# EAGLE schematic Display (EAGLE 7.2.0)
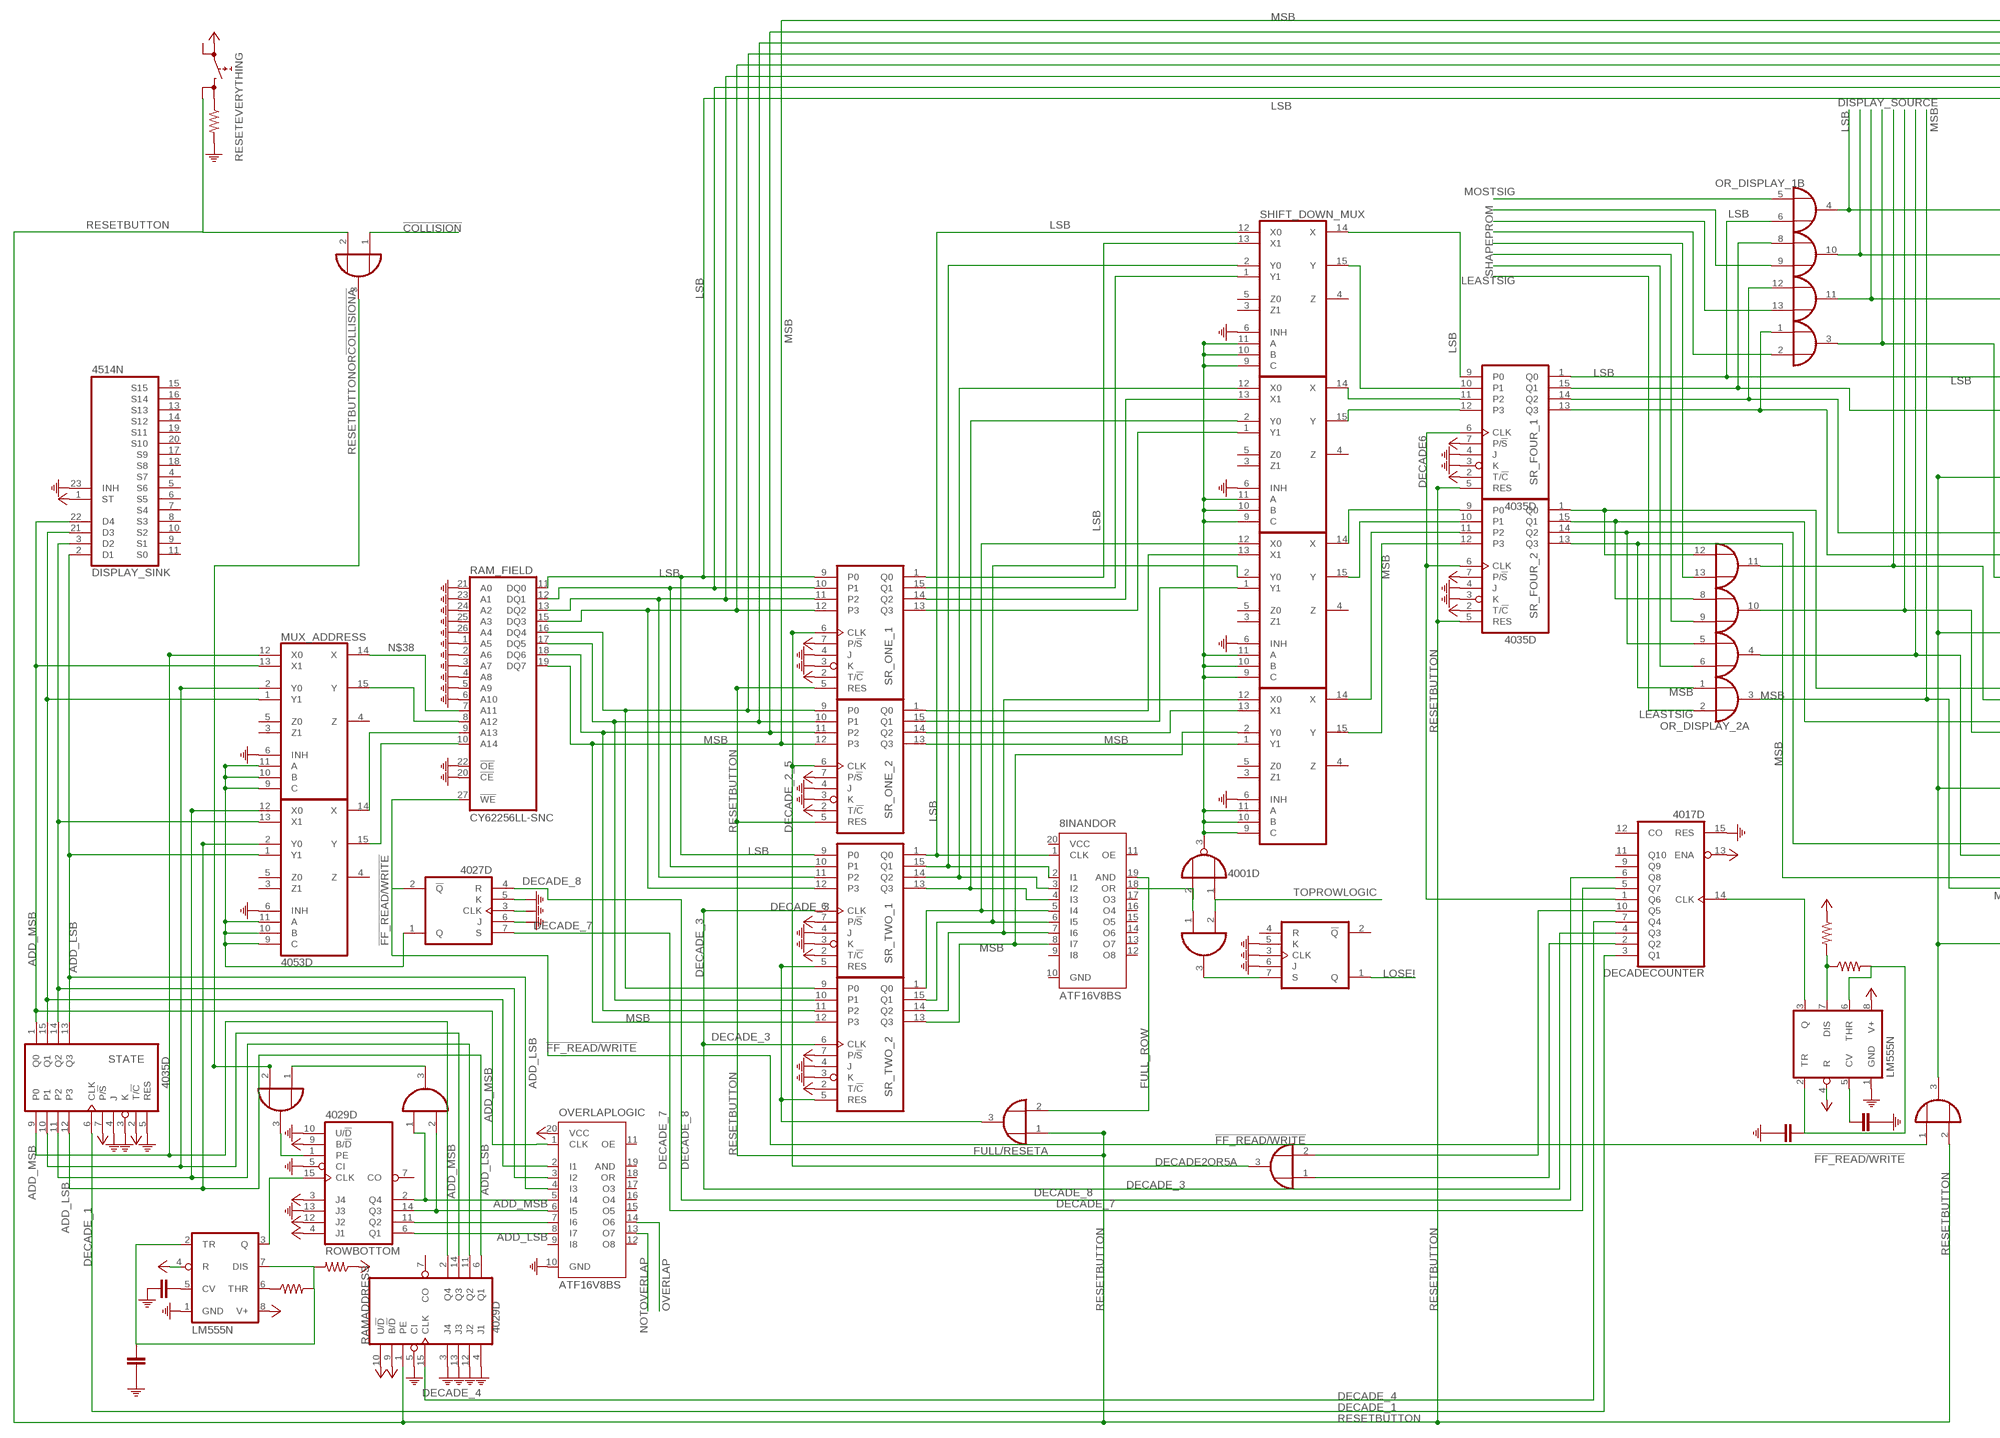
[diagram p0: schematic, sheet 1, part 1 of 2]
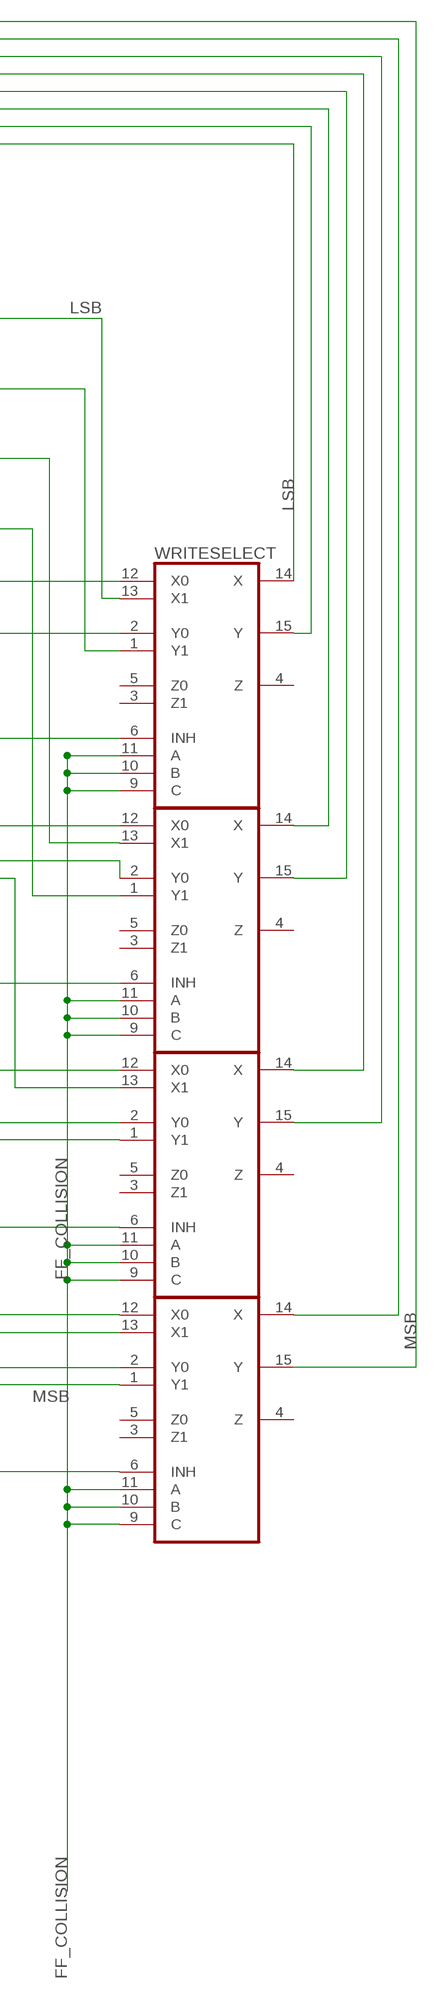
[diagram p1: schematic, sheet 1, part 2 of 2]

## Parts
1/3HZ  LM555N  [DIL08]
8INANDOR  ATF16V8BS  [SO20L]
9KHZ  LM555N  [DIL08]
DECADE2OR5  4071D  [SO14]
DECADECOUNTER  4017D  [SO16]
DISPLAY_SINK  4514N  [DIL24-6]
FF_R/W(H=WRITE)  4027D  [SO16]
FULL/RESET  4071D  [SO14]
IC1  4071D  [SO14]
IC3  4071D  [SO14]
IC8  4081D  [SO14]
IC9  4027D  [SO16]
IC10  4053D  [SO16]
IC13  4001D  [SO14]
IC15  4081D  [SO14]
IC16  4053D  [SO16]
IC17  4053D  [SO16]
IC18  4053D  [SO16]
IC20  4053D  [SO16]
IC21  4053D  [SO16]
IC22  4053D  [SO16]
MUX_ADDRESS  4053D  [SO16]
OR_DISPLAY_1  4071D  [SO14]
OR_DISPLAY_2  4071D  [SO14]
OVERLAPLOGIC  ATF16V8BS  [SO20L]
R1  R-US_0204/7  [0204/7]
R4  R-US_0204/7  [0204/7]
R5  R-US_0204/7  [0204/7]
R6  R-US_0204/7  [0204/7]
R7  R-US_0204/7  [0204/7]
RAM_FIELD  CY62256LL-SNC  [SOJ28/3]
RAMADDRESS  4029D  [SO16]
RESETBUTTONOR!COLLISION  4071D  [SO14]
RESETEVERYTHING  REKN  [REKN]
ROWBOTTOM  4029D  [SO16]
SHIFT_DOWN_MUX  4053D  [SO16]
SR_FOUR_1  4035D  [SO16]
SR_FOUR_2  4035D  [SO16]
SR_ONE_1  4035D  [SO16]
SR_ONE_2  4035D  [SO16]
SR_TWO_1  4035D  [SO16]
SR_TWO_2  4035D  [SO16]
STATE  4035D  [SO16]
WRITESELECT  4053D  [SO16]

## Nets
!COLLISION: RESETBUTTONOR!COLLISION.1(A:I0)
!FF_READ/WRITE: FF_R/W(H=WRITE).2(A:!Q) IC1.1(A:I0) RAM_FIELD.27(!WE)
ADD_LSB: DISPLAY_SINK.2(D1) IC10.1(Y1) IC10.2(Y0) OVERLAPLOGIC.4(I3) OVERLAPLOGIC.8(I7) RAMADDRESS.6(Q1) ROWBOTTOM.6(Q1) STATE.12(P3) STATE.13(Q3)
ADD_MSB: DISPLAY_SINK.22(D4) IC8.1(A:I0) MUX_ADDRESS.12(X0) MUX_ADDRESS.13(X1) OVERLAPLOGIC.5(I4) RAMADDRESS.2(Q4) ROWBOTTOM.2(Q4) STATE.1(Q0) STATE.9(P0)
DECADE6: DECADECOUNTER.1(Q6) SR_FOUR_1.6(CLK) SR_FOUR_2.6(CLK)
DECADE_1: DECADECOUNTER.3(Q1) STATE.6(CLK)
DECADE_2_5: DECADE2OR5.3(A:O) SR_ONE_1.6(CLK) SR_ONE_2.6(CLK)
DECADE_3: DECADECOUNTER.4(Q3) SR_TWO_1.6(CLK) SR_TWO_2.6(CLK)
DECADE_4: DECADECOUNTER.7(Q4) RAMADDRESS.15(CLK)
DECADE_7: DECADECOUNTER.5(Q7) FF_R/W(H=WRITE).7(A:S)
DECADE_8: DECADECOUNTER.6(Q8) FF_R/W(H=WRITE).4(A:R)
DISPLAY_SOURCE: OR_DISPLAY_1.10(C:O) WRITESELECT.1(Y1)
FF_COLLISION: IC20.9(C) IC20.10(B) IC20.11(A) IC21.9(C) IC21.10(B) IC21.11(A) IC22.9(C) IC22.10(B) IC22.11(A) WRITESELECT.9(C) WRITESELECT.10(B) WRITESELECT.11(A)
FULL_ROW: 8INANDOR.19(AND) FULL/RESET.2(A:I1)
LEASTSIG: OR_DISPLAY_2.2(A:I1)
LOSE!: IC9.1(A:Q)
LSB: 8INANDOR.1(CLK) OR_DISPLAY_1.4(B:O) OR_DISPLAY_1.6(B:I1) RAM_FIELD.11(DQ0) SHIFT_DOWN_MUX.12(X0) SHIFT_DOWN_MUX.13(X1) SHIFT_DOWN_MUX.14(X) SR_FOUR_1.1(Q0) SR_FOUR_1.9(P0) SR_ONE_1.1(Q0) SR_ONE_1.9(P0) SR_TWO_1.1(Q0) SR_TWO_1.9(P0) WRITESELECT.12(X0) WRITESELECT.13(X1) WRITESELECT.14(X)
MOSTSIG: OR_DISPLAY_1.5(B:I0)
MSB: 8INANDOR.8(I7) IC16.1(Y1) IC16.2(Y0) IC16.15(Y) IC20.1(Y1) IC20.2(Y0) IC20.15(Y) OR_DISPLAY_2.1(A:I0) OR_DISPLAY_2.3(A:O) RAM_FIELD.19(DQ7) SR_FOUR_2.12(P3) SR_FOUR_2.13(Q3) SR_ONE_2.12(P3) SR_ONE_2.13(Q3) SR_TWO_2.12(P3) SR_TWO_2.13(Q3)
N$1: 9KHZ.7(DIS) R4.2 R5.1
N$2: IC1.3(A:O) IC20.6(INH) IC21.6(INH) IC22.6(INH) WRITESELECT.6(INH)
N$3: IC8.2(A:I1) OVERLAPLOGIC.6(I5) ROWBOTTOM.14(Q3)
N$4: 9KHZ.6(THR)
N$5: IC3.3(A:O) ROWBOTTOM.1(PE)
N$6: IC3.2(A:I1) RESETBUTTONOR!COLLISION.3(A:O)
N$7: OVERLAPLOGIC.7(I6) ROWBOTTOM.11(Q2)
N$8: R1.1 RESETEVERYTHING.1A
N$9: IC10.12(X0) RAMADDRESS.11(Q2) STATE.11(P2)
N$10: 9KHZ.5(CV)
N$12: IC22.15(Y)
N$13: 1/3HZ.6(THR) R7.1
N$14: FF_R/W(H=WRITE).1(A:Q) IC10.9(C) IC10.10(B) IC10.11(A) MUX_ADDRESS.9(C) MUX_ADDRESS.10(B) MUX_ADDRESS.11(A)
N$15: IC21.15(Y) RAM_FIELD.17(DQ5) SR_ONE_2.10(P1) SR_TWO_2.10(P1)
N$16: IC20.14(X)
N$17: 1/3HZ.2(TR) 1/3HZ.7(DIS) R6.2 R7.2
N$18: 9KHZ.2(TR) R5.2
N$19: 1/3HZ.3(Q) ROWBOTTOM.15(CLK)
N$20: MUX_ADDRESS.2(Y0) RAMADDRESS.14(Q3) STATE.10(P1)
N$21: RAM_FIELD.15(DQ3) SR_ONE_1.12(P3) SR_TWO_1.12(P3)
N$22: 9KHZ.3(Q) DECADECOUNTER.14(CLK)
N$23: FULL/RESET.3(A:O) SR_TWO_1.5(RES) SR_TWO_2.5(RES)
N$24: IC3.1(A:I0) IC8.3(A:O)
N$27: DISPLAY_SINK.21(D3) MUX_ADDRESS.1(Y1) OVERLAPLOGIC.2(I1) STATE.15(Q1)
N$29: OR_DISPLAY_2.13(D:I1)
N$31: OR_DISPLAY_1.13(D:I1)
N$32: OR_DISPLAY_2.6(B:I1)
N$34: OR_DISPLAY_2.9(C:I1)
N$35: OR_DISPLAY_1.2(A:I1)
N$36: DISPLAY_SINK.3(D2) IC10.13(X1) OVERLAPLOGIC.3(I2) STATE.14(Q2)
N$38: MUX_ADDRESS.14(X) RAM_FIELD.7(A11)
N$39: MUX_ADDRESS.15(Y) RAM_FIELD.8(A12)
N$40: OVERLAPLOGIC.1(CLK)
N$42: IC10.14(X) RAM_FIELD.9(A13)
N$43: IC10.15(Y) RAM_FIELD.10(A14)
N$45: IC22.14(X) RAM_FIELD.13(DQ2) SR_ONE_1.11(P2) SR_TWO_1.11(P2)
N$46: RAM_FIELD.12(DQ1) SR_ONE_1.10(P1) SR_TWO_1.10(P1) WRITESELECT.15(Y)
N$47: IC21.14(X) RAM_FIELD.16(DQ4) SR_ONE_2.9(P0) SR_TWO_2.9(P0)
N$49: 8INANDOR.2(I1) SHIFT_DOWN_MUX.2(Y0) SR_TWO_1.15(Q1)
N$52: DECADE2OR5.1(A:I0) DECADECOUNTER.2(Q2)
N$53: IC18.15(Y) SR_FOUR_1.12(P3)
N$54: DECADE2OR5.2(A:I1) DECADECOUNTER.10(Q5)
N$55: IC18.14(X) SR_FOUR_1.11(P2)
N$56: 8INANDOR.3(I2) IC18.12(X0) SR_TWO_1.14(Q2)
N$57: RAM_FIELD.18(DQ6) SR_ONE_2.11(P2) SR_TWO_2.11(P2)
N$58: 8INANDOR.4(I3) IC18.2(Y0) SR_TWO_1.13(Q3)
N$59: 8INANDOR.5(I4) IC17.12(X0) SR_TWO_2.1(Q0)
N$60: 8INANDOR.6(I5) IC17.2(Y0) SR_TWO_2.15(Q1)
N$61: 8INANDOR.7(I6) IC16.12(X0) SR_TWO_2.14(Q2)
N$64: 8INANDOR.18(OR) IC13.2(A:I1) IC15.1(A:I0)
N$65: IC9.7(A:S) IC15.3(A:O)
N$66: IC13.3(A:O) IC16.9(C) IC16.10(B) IC16.11(A) IC17.9(C) IC17.10(B) IC17.11(A) IC18.9(C) IC18.10(B) IC18.11(A) SHIFT_DOWN_MUX.9(C) SHIFT_DOWN_MUX.10(B) SHIFT_DOWN_MUX.11(A)
N$68: SHIFT_DOWN_MUX.1(Y1) SR_ONE_1.15(Q1)
N$69: IC18.13(X1) SR_ONE_1.14(Q2)
N$70: IC18.1(Y1) SR_ONE_1.13(Q3)
N$71: IC17.13(X1) SR_ONE_2.1(Q0)
N$72: IC17.1(Y1) SR_ONE_2.15(Q1)
N$73: IC16.13(X1) SR_ONE_2.14(Q2)
N$75: SHIFT_DOWN_MUX.15(Y) SR_FOUR_1.10(P1)
N$76: IC17.14(X) SR_FOUR_2.9(P0)
N$77: IC17.15(Y) SR_FOUR_2.10(P1)
N$80: IC16.14(X) SR_FOUR_2.11(P2)
N$82: IC21.12(X0) OR_DISPLAY_2.12(D:I0) SR_FOUR_2.1(Q0)
N$83: IC22.12(X0) OR_DISPLAY_1.12(D:I0) SR_FOUR_1.14(Q2)
N$84: IC22.2(Y0) OR_DISPLAY_1.1(A:I0) SR_FOUR_1.13(Q3)
N$85: OR_DISPLAY_1.8(C:I0) SR_FOUR_1.15(Q1) WRITESELECT.2(Y0)
N$86: IC20.12(X0) OR_DISPLAY_2.5(B:I0) SR_FOUR_2.14(Q2)
N$87: IC21.2(Y0) OR_DISPLAY_2.8(C:I0) SR_FOUR_2.15(Q1)
N$92: IC22.13(X1) OR_DISPLAY_1.11(D:O)
N$93: IC22.1(Y1) OR_DISPLAY_1.3(A:O)
N$94: IC21.13(X1) OR_DISPLAY_2.11(D:O)
N$95: IC21.1(Y1) OR_DISPLAY_2.10(C:O)
N$96: IC20.13(X1) OR_DISPLAY_2.4(B:O)
NOTOVERLAP: OVERLAPLOGIC.13(O7)
OVERLAP: OVERLAPLOGIC.14(O6)
PE: 1/3HZ.1(GND) 9KHZ.1(GND) DECADECOUNTER.15(RES) DISPLAY_SINK.23(INH) FF_R/W(H=WRITE).3(A:CLK) FF_R/W(H=WRITE).5(A:K) FF_R/W(H=WRITE).6(A:J) IC9.3(A:CLK) IC9.5(A:K) IC9.6(A:J) IC10.6(INH) IC16.6(INH) IC17.6(INH) IC18.6(INH) MUX_ADDRESS.6(INH) OVERLAPLOGIC.10(GND) R1.2 RAM_FIELD.1(A5) RAM_FIELD.2(A6) RAM_FIELD.3(A7) RAM_FIELD.4(A8) RAM_FIELD.5(A9) RAM_FIELD.6(A10) RAM_FIELD.20(!CE) RAM_FIELD.21(A0) RAM_FIELD.22(!OE) RAM_FIELD.23(A1) RAM_FIELD.24(A2) RAM_FIELD.25(A3) RAM_FIELD.26(A4) RAMADDRESS.3(J4) RAMADDRESS.4(J1) RAMADDRESS.5(CI) RAMADDRESS.12(J2) RAMADDRESS.13(J3) ROWBOTTOM.5(CI) ROWBOTTOM.10(U/!D) ROWBOTTOM.13(J3) SHIFT_DOWN_MUX.6(INH) SR_FOUR_1.3(K) SR_FOUR_1.4(J) SR_FOUR_2.3(K) SR_FOUR_2.4(J) SR_ONE_1.3(K) SR_ONE_1.4(J) SR_ONE_2.3(K) SR_ONE_2.4(J) SR_TWO_1.3(K) SR_TWO_1.4(J) SR_TWO_2.3(K) SR_TWO_2.4(J) STATE.3(K) STATE.4(J) STATE.5(RES)
RESETBUTTON: FULL/RESET.1(A:I0) IC1.2(A:I1) RAMADDRESS.1(PE) RESETBUTTONOR!COLLISION.2(A:I1) RESETEVERYTHING.1B SR_FOUR_1.5(RES) SR_FOUR_2.5(RES) SR_ONE_1.5(RES) SR_ONE_2.5(RES)
SHAPEPROM: OR_DISPLAY_1.9(C:I1)
TOPROWLOGIC: IC13.1(A:I0) IC15.2(A:I1)
V+: 1/3HZ.4(R) 1/3HZ.8(V+) 9KHZ.4(R) 9KHZ.8(V+) DECADECOUNTER.13(ENA) DISPLAY_SINK.1(ST) OVERLAPLOGIC.20(VCC) R4.1 R6.1 RAMADDRESS.9(B/!D) RAMADDRESS.10(U/!D) RESETEVERYTHING.0A ROWBOTTOM.3(J4) ROWBOTTOM.4(J1) ROWBOTTOM.9(B/!D) ROWBOTTOM.12(J2) SR_FOUR_1.2(T/!C) SR_FOUR_1.7(P/!S) SR_FOUR_2.2(T/!C) SR_FOUR_2.7(P/!S) SR_ONE_1.2(T/!C) SR_ONE_1.7(P/!S) SR_ONE_2.2(T/!C) SR_ONE_2.7(P/!S) SR_TWO_1.2(T/!C) SR_TWO_1.7(P/!S) SR_TWO_2.2(T/!C) SR_TWO_2.7(P/!S) STATE.2(T/!C) STATE.7(P/!S)
Unconnected: 1/3HZ.5(CV) 8INANDOR.9(I8) 8INANDOR.11(OE) 8INANDOR.12(O8) 8INANDOR.13(O7) 8INANDOR.14(O6) 8INANDOR.15(O5) 8INANDOR.16(O4) 8INANDOR.17(O3) DECADE2OR5.4(B:O) DECADE2OR5.5(B:I0) DECADE2OR5.6(B:I1) DECADE2OR5.8(C:I0) DECADE2OR5.9(C:I1) DECADE2OR5.10(C:O) DECADE2OR5.11(D:O) DECADE2OR5.12(D:I0) DECADE2OR5.13(D:I1) DECADECOUNTER.9(Q9) DECADECOUNTER.11(Q10) DECADECOUNTER.12(CO) DISPLAY_SINK.4(S7) DISPLAY_SINK.5(S6) DISPLAY_SINK.6(S5) DISPLAY_SINK.7(S4) DISPLAY_SINK.8(S3) DISPLAY_SINK.9(S1) DISPLAY_SINK.10(S2) DISPLAY_SINK.11(S0) DISPLAY_SINK.13(S13) DISPLAY_SINK.14(S12) DISPLAY_SINK.15(S15) DISPLAY_SINK.16(S14) DISPLAY_SINK.17(S9) DISPLAY_SINK.18(S8) DISPLAY_SINK.19(S11) DISPLAY_SINK.20(S10) FF_R/W(H=WRITE).9(B:S) FF_R/W(H=WRITE).10(B:J) FF_R/W(H=WRITE).11(B:K) FF_R/W(H=WRITE).12(B:R) FF_R/W(H=WRITE).13(B:CLK) FF_R/W(H=WRITE).14(B:!Q) FF_R/W(H=WRITE).15(B:Q) FULL/RESET.4(B:O) FULL/RESET.5(B:I0) FULL/RESET.6(B:I1) FULL/RESET.8(C:I0) FULL/RESET.9(C:I1) FULL/RESET.10(C:O) FULL/RESET.11(D:O) FULL/RESET.12(D:I0) FULL/RESET.13(D:I1) IC1.4(B:O) IC1.5(B:I0) IC1.6(B:I1) IC1.8(C:I0) IC1.9(C:I1) IC1.10(C:O) IC1.11(D:O) IC1.12(D:I0) IC1.13(D:I1) IC3.4(B:O) IC3.5(B:I0) IC3.6(B:I1) IC3.8(C:I0) IC3.9(C:I1) IC3.10(C:O) IC3.11(D:O) IC3.12(D:I0) IC3.13(D:I1) IC8.4(B:O) IC8.5(B:I0) IC8.6(B:I1) IC8.8(C:I0) IC8.9(C:I1) IC8.10(C:O) IC8.11(D:O) IC8.12(D:I0) IC8.13(D:I1) IC9.2(A:!Q) IC9.4(A:R) IC9.9(B:S) IC9.10(B:J) IC9.11(B:K) IC9.12(B:R) IC9.13(B:CLK) IC9.14(B:!Q) IC9.15(B:Q) IC10.3(Z1) IC10.4(Z) IC10.5(Z0) IC13.4(B:O) IC13.5(B:I0) IC13.6(B:I1) IC13.8(C:I0) IC13.9(C:I1) IC13.10(C:O) IC13.11(D:O) IC13.12(D:I0) IC13.13(D:I1) IC15.4(B:O) IC15.5(B:I0) IC15.6(B:I1) IC15.8(C:I0) IC15.9(C:I1) IC15.10(C:O) IC15.11(D:O) IC15.12(D:I0) IC15.13(D:I1) IC16.3(Z1) IC16.4(Z) IC16.5(Z0) IC17.3(Z1) IC17.4(Z) IC17.5(Z0) IC18.3(Z1) IC18.4(Z) IC18.5(Z0) IC20.3(Z1) IC20.4(Z) IC20.5(Z0) IC21.3(Z1) IC21.4(Z) IC21.5(Z0) IC22.3(Z1) IC22.4(Z) IC22.5(Z0) MUX_ADDRESS.3(Z1) MUX_ADDRESS.4(Z) MUX_ADDRESS.5(Z0) OVERLAPLOGIC.9(I8) OVERLAPLOGIC.11(OE) OVERLAPLOGIC.12(O8) OVERLAPLOGIC.15(O5) OVERLAPLOGIC.16(O4) OVERLAPLOGIC.17(O3) OVERLAPLOGIC.18(OR) OVERLAPLOGIC.19(AND) RAMADDRESS.7(CO) RESETBUTTONOR!COLLISION.4(B:O) RESETBUTTONOR!COLLISION.5(B:I0) RESETBUTTONOR!COLLISION.6(B:I1) RESETBUTTONOR!COLLISION.8(C:I0) RESETBUTTONOR!COLLISION.9(C:I1) RESETBUTTONOR!COLLISION.10(C:O) RESETBUTTONOR!COLLISION.11(D:O) RESETBUTTONOR!COLLISION.12(D:I0) RESETBUTTONOR!COLLISION.13(D:I1) RESETEVERYTHING.0B ROWBOTTOM.7(CO) SHIFT_DOWN_MUX.3(Z1) SHIFT_DOWN_MUX.4(Z) SHIFT_DOWN_MUX.5(Z0) WRITESELECT.3(Z1) WRITESELECT.4(Z) WRITESELECT.5(Z0)

## Power pins joined to a net without a drawn wire
GND: 8INANDOR.10(GND) IC10.8(GND) IC16.8(GND) IC17.8(GND) IC18.8(GND) IC20.8(GND) IC21.8(GND) IC22.8(GND) MUX_ADDRESS.8(GND) RAM_FIELD.14(GND) SHIFT_DOWN_MUX.8(GND) WRITESELECT.8(GND)
VCC: 8INANDOR.20(VCC) IC10.16(VCC) IC16.16(VCC) IC17.16(VCC) IC18.16(VCC) IC20.16(VCC) IC21.16(VCC) IC22.16(VCC) MUX_ADDRESS.16(VCC) RAM_FIELD.28(VCC) SHIFT_DOWN_MUX.16(VCC) WRITESELECT.16(VCC)
VDD: DECADE2OR5.14(P:VDD) DECADECOUNTER.16(VDD) DISPLAY_SINK.24(VDD) FF_R/W(H=WRITE).16(P:VDD) FULL/RESET.14(P:VDD) IC1.14(P:VDD) IC3.14(P:VDD) IC8.14(P:VDD) IC9.16(P:VDD) IC13.14(P:VDD) IC15.14(P:VDD) OR_DISPLAY_1.14(P:VDD) OR_DISPLAY_2.14(P:VDD) RAMADDRESS.16(VDD) RESETBUTTONOR!COLLISION.14(P:VDD) ROWBOTTOM.16(VDD) SR_FOUR_1.16(VDD) SR_FOUR_2.16(VDD) SR_ONE_1.16(VDD) SR_ONE_2.16(VDD) SR_TWO_1.16(VDD) SR_TWO_2.16(VDD) STATE.16(VDD)
VEE: IC10.7(VEE) IC16.7(VEE) IC17.7(VEE) IC18.7(VEE) IC20.7(VEE) IC21.7(VEE) IC22.7(VEE) MUX_ADDRESS.7(VEE) SHIFT_DOWN_MUX.7(VEE) WRITESELECT.7(VEE)
VSS: DECADE2OR5.7(P:VSS) DECADECOUNTER.8(VSS) DISPLAY_SINK.12(VSS) FF_R/W(H=WRITE).8(P:VSS) FULL/RESET.7(P:VSS) IC1.7(P:VSS) IC3.7(P:VSS) IC8.7(P:VSS) IC9.8(P:VSS) IC13.7(P:VSS) IC15.7(P:VSS) OR_DISPLAY_1.7(P:VSS) OR_DISPLAY_2.7(P:VSS) RAMADDRESS.8(VSS) RESETBUTTONOR!COLLISION.7(P:VSS) ROWBOTTOM.8(VSS) SR_FOUR_1.8(VSS) SR_FOUR_2.8(VSS) SR_ONE_1.8(VSS) SR_ONE_2.8(VSS) SR_TWO_1.8(VSS) SR_TWO_2.8(VSS) STATE.8(VSS)

## Library data of the parts
1/3HZ 9KHZ = linear:*555: TIMER
8INANDOR OVERLAPLOGIC = atmel:ATF16V8B: High perfomance CMOS (electrically erasable) programmable logic device (PLD) ABLE-Atmel-ABEL - P18V8R, P16V8C, P16V8AS, P17V8 COPL Atmel-WinCUPL - G16V8MS, G16V8MA, G16V8AS, G16V8 LOG/IC - GAL16V8_R, GAL16V8_G7, GAL16V8_C), GAL16V8 Tango-PLD - G16V8R, G16V8C, G16V8AS, G16V8 Source: http://www.atmel.com/dyn/resources/prod_documents/DOC0364.PDF; OC_FARNELL: unknown; OC_NEWARK: unknown
DECADE2OR5 FULL/RESET IC1 IC3 OR_DISPLAY_1 OR_DISPLAY_2 RESETBUTTONOR!COLLISION = 40xx:4071: Quad 2-input OR
DECADECOUNTER = 40xx:4017: COUNTER/DIVIDER
DISPLAY_SINK = 45xx:4514: 4-bit latch 4-16 line DECODER
FF_R/W(H=WRITE) IC9 = 40xx:4027: Dual JK FLIP FLOP
IC8 IC15 = 40xx:4081: Quad 2-input AND
IC10 IC16-IC18 IC20-IC22 MUX_ADDRESS SHIFT_DOWN_MUX WRITESELECT = 40xx:4053: Triple 2-channel ANALOG MULTIPLEXER
IC13 = 40xx:4001: Quad 2-input NOR
R1 R4-R7 = rcl:R-US_: RESISTOR, American symbol
RAM_FIELD = memory-sram:CY62256LL-?*: 256K (32K x 8) CMOS-Static RAM Source: http://download.cypress.com.edgesuite.net/design_resources/datasheets/contents/cy62256_8.pdf
RAMADDRESS ROWBOTTOM = 40xx:4029: Binary/decimal up/down COUNTER
RESETEVERYTHING = switch:REKN: PUSH SWITCH ITT-Cannon-Cannon
SR_FOUR_1 SR_FOUR_2 SR_ONE_1 SR_ONE_2 SR_TWO_1 SR_TWO_2 STATE = 40xx:4035: 4-bit parallel in/out SHIFT REGISTER